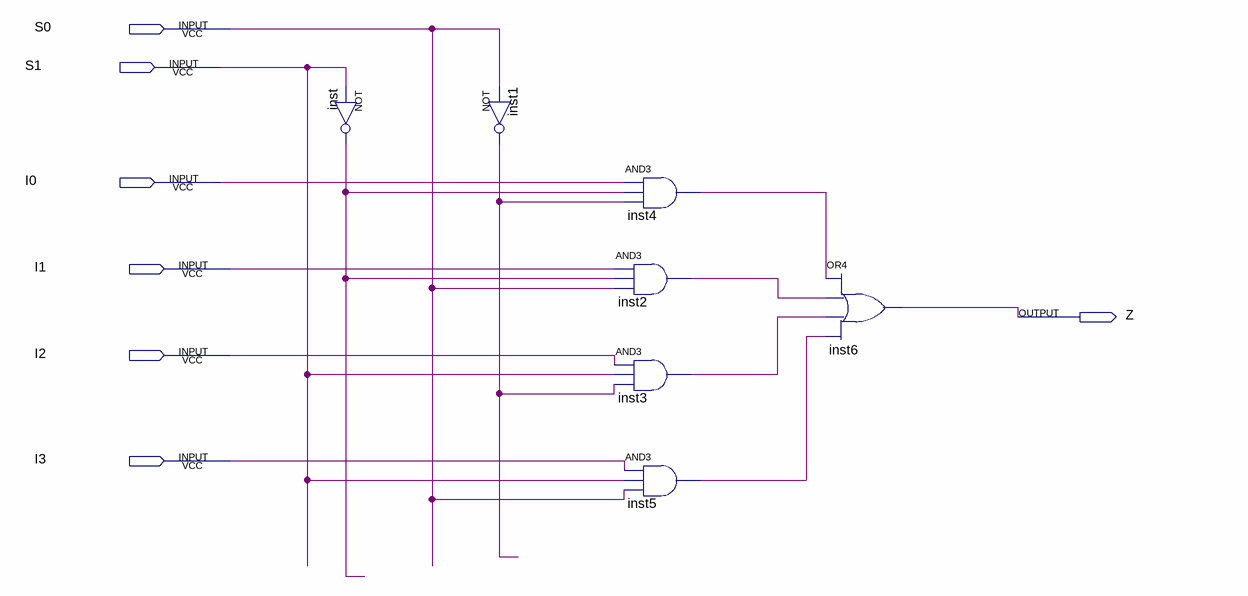
[diagram p0: schematic sheet]
// Quartus schematic hw602.bdf as structural Verilog: 7 symbols, 7 pins
module hw602 (
  input  S0,
  input  S1,
  input  I0,
  input  I1,
  input  I2,
  input  I3,
  output Z
);

  wire inst1_out, inst2_out, inst3_out, inst4_out, inst5_out, inst_out;

  not inst (inst_out, S1);
  not inst1 (inst1_out, S0);
  and inst4 (inst4_out, I0, inst_out, inst1_out);
  and inst2 (inst2_out, I1, inst_out, S0);
  and inst3 (inst3_out, I2, S1, inst1_out);
  and inst5 (inst5_out, I3, S1, S0);
  or inst6 (Z, inst4_out, inst2_out, inst3_out, inst5_out);
endmodule
